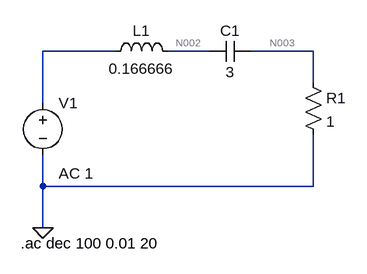
[diagram p0: schematic Draft1.asc]
Draft1.asc, the LTspice schematic file:
Version 4
SHEET 1 880 680
WIRE 160 48 48 48
WIRE 304 48 240 48
WIRE 464 48 368 48
WIRE 464 96 464 48
WIRE 48 128 48 48
WIRE 48 256 48 208
WIRE 464 256 464 176
WIRE 464 256 48 256
WIRE 48 320 48 256
FLAG 48 320 0
SYMBOL voltage 48 112 R0
WINDOW 123 24 124 Left 2
WINDOW 39 0 0 Left 0
SYMATTR InstName V1
SYMATTR Value ""
SYMATTR Value2 AC 1
SYMBOL cap 368 32 R90
WINDOW 0 0 32 VBottom 2
WINDOW 3 32 32 VTop 2
SYMATTR InstName C1
SYMATTR Value 3
SYMBOL res 448 80 R0
SYMATTR InstName R1
SYMATTR Value 1
SYMBOL ind 144 64 R270
WINDOW 0 32 56 VTop 2
WINDOW 3 5 56 VBottom 2
SYMATTR InstName L1
SYMATTR Value 0.166666
TEXT 14 344 Left 2 !.ac dec 100 0.01 20

The netlist it stands for:
* Draft1.asc
V1 N001 0 AC 1
C1 N003 N002 3
R1 N003 0 1
L1 N001 N002 0.166666
.ac dec 100 0.01 20
.backanno
.end

* Results of the author's LTspice run, read from the files saved beside the schematic
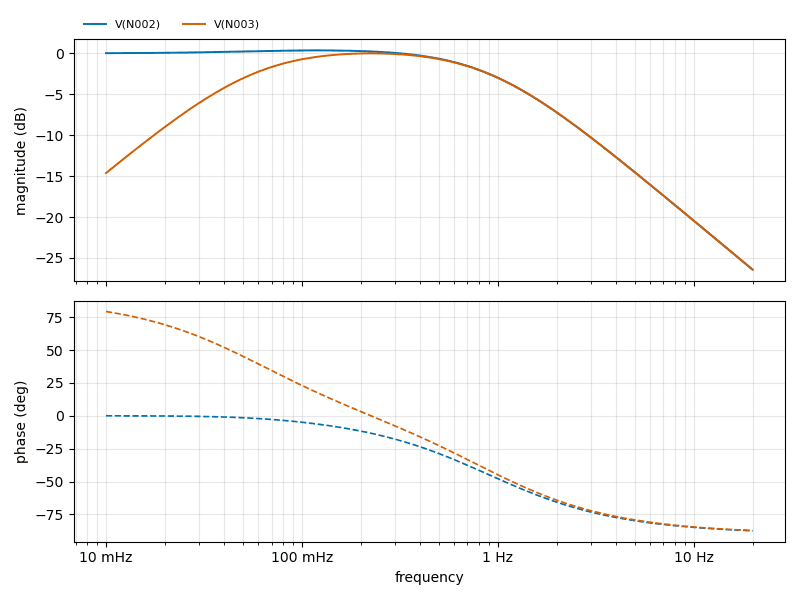
[diagram p1: AC Analysis of Draft1.asc, plotted from the saved traces]
* AC Analysis, 1 run:
*   V(N002): 0.02 dB at 10 mHz, -26.43 dB at 20 Hz, peak 0.35 dB at 120.2 mHz, 3 dB below the peak at 933.5 mHz
*   V(N003): -14.63 dB at 10 mHz, -26.43 dB at 20 Hz, peak -0.01 dB at 223.9 mHz, 3 dB below the peak at 50.35 mHz and 1.006 Hz